# Altium schematic sheet Main.SchDoc
size A3; SheetNumber: 1; SheetTotal: 10
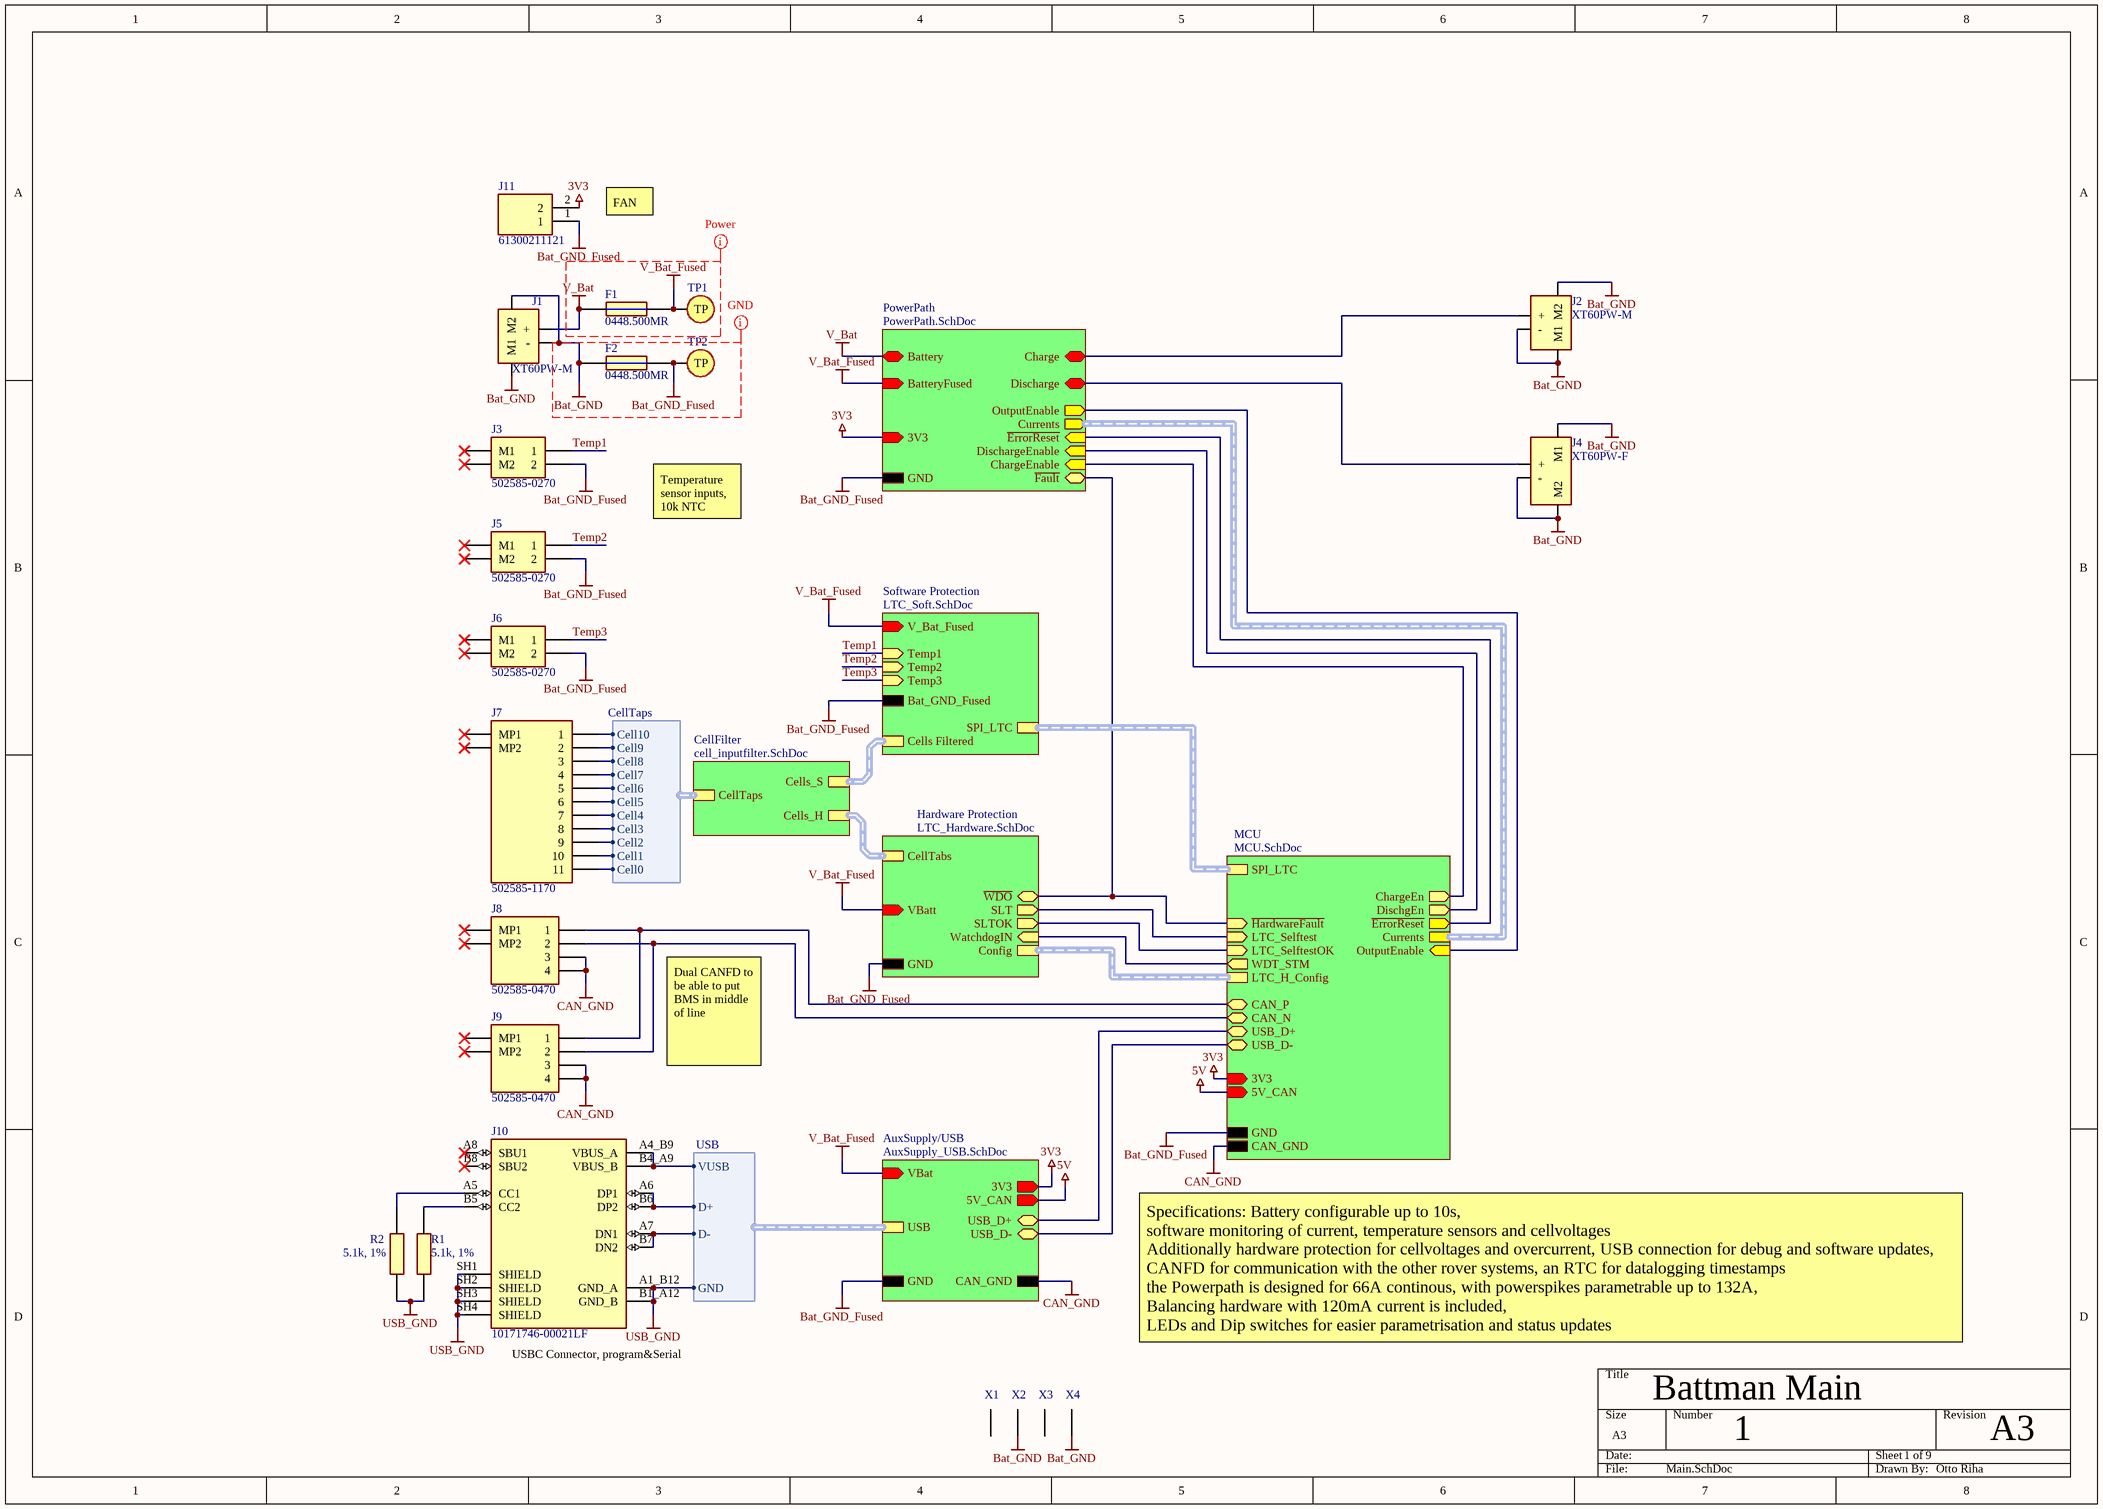
[diagram p0: Main.SchDoc]

## Parts
F1  0448.500MR  [FUSC6127X294N]
F2  0448.500MR  [FUSC6127X294N]
J1  XT60PW-M  [XT60PWM]
J2  XT60PW-M  [XT60PWM]
J3  502585-0270  [5025850270]
J4  XT60PW-F  [XT60PWF]
J5  502585-0270  [5025850270]
J6  502585-0270  [5025850270]
J7  502585-1170  [5025851170]
J8  502585-0470  [5025850470]
J9  502585-0470  [5025850470]
J10  10171746-00021LF  [AMPHENOL_10171746-00021LF]
J11  61300211121  [HDRV2W110P0X254_1X2_508X254X854P]
R1  5.1k, 1%  [RESC1608X55N]
R2  5.1k, 1%  [RESC1608X55N]
TP1  Testpoint  [Testpoint]  (value not drawn)
TP2  Testpoint  [Testpoint]  (value not drawn)
X1  Trou pour Vis M3 celon DIN912  [VisM3]  (value not drawn)
X2  Trou pour Vis M3 celon DIN912  [VisM3]  (value not drawn)
X3  Trou pour Vis M3 celon DIN912  [VisM3]  (value not drawn)
X4  Trou pour Vis M3 celon DIN912  [VisM3]  (value not drawn)

## Sub-sheets
AuxSupply/USB = AuxSupply_USB.SchDoc: VBat (in), GND, 5V_CAN (out), 3V3 (out), USB (harness USB), USB_D+ (bidir), USB_D- (bidir), CAN_GND
CellFilter = cell_inputfilter.SchDoc: CellTaps (harness CellTaps), Cells_H (harness Hardware Protection Taps), Cells_S (harness Software Protection Taps)
Hardware Protection = LTC_Hardware.SchDoc: CellTabs (harness Hardware Protection Taps), SLT (out), SLTOK (out), Config (harness LTC_H_Config), WatchdogIN (in), ~{WDO} (bidir), GND, VBatt (in)
MCU = MCU.SchDoc: SPI_LTC (harness SPI_LTC), CAN_P (bidir), CAN_N (bidir), USB_D+ (bidir), USB_D- (bidir), 3V3 (in), 5V_CAN (in), GND, LTC_H_Config (harness LTC_H_Config), ChargeEn (out), DischgEn (out), WDT_STM (out), ~{HardwareFault} (in), LTC_Selftest (in), LTC_SelftestOK (in), ~{ErrorReset} (out), OutputEnable (in), Currents (harness Currents), CAN_GND
PowerPath = PowerPath.SchDoc: Battery (bidir), BatteryFused (in), 3V3 (in), GND, Currents (out), Charge (bidir), ~{Fault} (bidir), Discharge (bidir), ChargeEnable (in), DischargeEnable (in), OutputEnable (out), ~{ErrorReset} (in)
Software Protection = LTC_Soft.SchDoc: Cells Filtered (harness Software Protection Taps), V_Bat_Fused (in), Bat_GND_Fused, Temp1 (in), Temp2 (in), Temp3 (in), SPI_LTC (harness SPI)

## Harnesses
CellTaps: Cell0, Cell1, Cell2, Cell3, Cell4, Cell5, Cell6, Cell7, Cell8, Cell9, Cell10
USB: VUSB, D+, D-, GND

## Nets
3V3: J11.2 ; sheet AuxSupply/USB/3V3, sheet MCU/3V3, sheet PowerPath/3V3
5V: sheet AuxSupply/USB/5V_CAN, sheet MCU/5V_CAN
Bat_GND: F2.1 J1.1(-) J1.M1 J1.M2 J2.1(-) J2.M1 J2.M2 J4.2(-) J4.3(M1) J4.4(M2) X2.1(M1) X4.1(M1)
Bat_GND_Fused: F2.2 J3.2 J5.2 J6.2 J11.1 TP2.1(TP) ; sheet Hardware Protection/GND, sheet AuxSupply/USB/GND, sheet Software Protection/Bat_GND_Fused, sheet MCU/GND, sheet PowerPath/GND
CAN_GND: J8.3 J8.4 J9.3 J9.4 ; sheet AuxSupply/USB/CAN_GND, sheet MCU/CAN_GND
USB_GND: J10.A1_B12(GND_A) J10.B1_A12(GND_B) J10.SH1(SHIELD) J10.SH2(SHIELD) J10.SH3(SHIELD) J10.SH4(SHIELD) R1.1 R2.1 ; sheet AuxSupply/USB/USB.GND
V_Bat: F1.1 J1.2(+) ; sheet PowerPath/Battery
V_Bat_Fused: F1.2 TP1.1(TP) ; sheet Hardware Protection/VBatt, sheet AuxSupply/USB/VBat, sheet Software Protection/V_Bat_Fused, sheet PowerPath/BatteryFused
Temp1: J3.1 ; sheet Software Protection/Temp1
Temp2: J5.1 ; sheet Software Protection/Temp2
Temp3: J6.1 ; sheet Software Protection/Temp3
NetJ2_2: J2.2(+) ; sheet PowerPath/Charge
NetJ4_1: J4.1(+) ; sheet PowerPath/Discharge
NetJ7_1: J7.1 ; sheet CellFilter/CellTaps.Cell10
NetJ7_2: J7.2 ; sheet CellFilter/CellTaps.Cell9
NetJ7_3: J7.3 ; sheet CellFilter/CellTaps.Cell8
NetJ7_4: J7.4 ; sheet CellFilter/CellTaps.Cell7
NetJ7_5: J7.5 ; sheet CellFilter/CellTaps.Cell6
NetJ7_6: J7.6 ; sheet CellFilter/CellTaps.Cell5
NetJ7_7: J7.7 ; sheet CellFilter/CellTaps.Cell4
NetJ7_8: J7.8 ; sheet CellFilter/CellTaps.Cell3
NetJ7_9: J7.9 ; sheet CellFilter/CellTaps.Cell2
NetJ7_10: J7.10 ; sheet CellFilter/CellTaps.Cell1
NetJ7_11: J7.11 ; sheet CellFilter/CellTaps.Cell0
NetJ8_1: J8.1 J9.1 ; sheet MCU/CAN_P
NetJ8_2: J8.2 J9.2 ; sheet MCU/CAN_N
NetJ10_A4_B9: J10.A4_B9(VBUS_A) J10.B4_A9(VBUS_B) ; sheet AuxSupply/USB/USB.VUSB
NetJ10_A5: J10.A5(CC1) R2.2
NetJ10_A6: J10.A6(DP1) J10.B6(DP2) ; sheet AuxSupply/USB/USB.D+
NetJ10_A7: J10.A7(DN1) J10.B7(DN2) ; sheet AuxSupply/USB/USB.D-
NetJ10_B5: J10.B5(CC2) R1.2
(unnamed): sheet Hardware Protection/SLT, sheet MCU/LTC_Selftest
(unnamed): sheet Hardware Protection/SLTOK, sheet MCU/LTC_SelftestOK
(unnamed): sheet Hardware Protection/WatchdogIN, sheet MCU/WDT_STM
(unnamed): sheet Hardware Protection/~{WDO}, sheet MCU/~{HardwareFault}, sheet PowerPath/~{Fault}
(unnamed): sheet AuxSupply/USB/USB_D+, sheet MCU/USB_D+
(unnamed): sheet AuxSupply/USB/USB_D-, sheet MCU/USB_D-
(unnamed): sheet MCU/ChargeEn, sheet PowerPath/ChargeEnable
(unnamed): sheet MCU/DischgEn, sheet PowerPath/DischargeEnable
(unnamed): sheet MCU/~{ErrorReset}, sheet PowerPath/~{ErrorReset}
(unnamed): sheet MCU/OutputEnable, sheet PowerPath/OutputEnable

Not connected (* = marked no-connect by the designer): J3 M1* M2*; J5 M1* M2*; J6 M1* M2*; J7 MP1* MP2*; J8 MP1* MP2*; J9 MP1* MP2*; J10 A8(SBU1)* B8(SBU2)*; X1 1(M1); X3 1(M1)

## Buses and harness runs
harness sheet CellFilter/Cells_H = sheet Hardware Protection/CellTabs
harness sheet CellFilter/Cells_S = sheet Software Protection/Cells Filtered
harness sheet Hardware Protection/Config = sheet MCU/LTC_H_Config
harness sheet MCU/Currents = sheet PowerPath/Currents
harness sheet MCU/SPI_LTC = sheet Software Protection/SPI_LTC

## Layout directives
net class GND: Bat_GND, Bat_GND_Fused
net class Batt+: V_Bat, V_Bat_Fused

## Notes on the sheet
- FAN
- Temperature sensor inputs, 10k NTC
- Dual CANFD to be able to put BMS in middle of line
- (near J10) USBC Connector, program&Serial
- Specifications: Battery configurable up to 10s,
  software monitoring of current, temperature sensors and cellvoltages
  Additionally hardware protection for cellvoltages and overcurrent, USB connection for debug and software updates, CANFD for communication with the other rover systems, an RTC for datalogging timestamps
  the Powerpath is designed for 66A continous, with powerspikes parametrable up to 132A,
  Balancing hardware with 120mA current is included,
  LEDs and Dip switches for easier parametrisation and status updates
- Battman Main
- 1
- 9
- A3
- Otto Riha
- System:
- Car Number:
- Author:
- 127
- Date:
- Sheet
- of
- Version :

## Library data of the parts
F1 F2 = 0448.500MR: Fuse; Manufacturer_Name: LITTELFUSE; Datasheet Link: https://www.mouser.in/datasheet/2/240/Littelfuse_Fuse_448_Datasheet_pdf-970935.pdf; Height: 2.94mm; Manufacturer_Part_Number: 0448.500MR; Mouser Part Number: 576-0448.500MR; Mouser Price/Stock: https://www.mouser.co.uk/ProductDetail/Littelfuse/0448.500MR?qs=sba%2FvSn%252BnuOI9c6%252BQVFrGA%3D%3D; Arrow Part Number: 0448.500MR; Arrow Price/Stock: https://www.arrow.com/en/products/0448.500mr/littelfuse
J1 J2 = XT60PW-M: Connector; Manufacturer_Name: Changzou Amass Elec; Datasheet Link: https://www.tme.eu/Document/9b8d0c5eb7094295f3d3112c214d3ade/XT60PW%20SPEC.pdf; Height: 8.4mm; Manufacturer_Part_Number: XT60PW-M
J3 J5 J6 = 502585-0270: Connector; Manufacturer_Name: Molex; Datasheet Link: https://www.molex.com/pdm_docs/sd/5025850270_sd.pdf; Height: 6.35mm; Manufacturer_Part_Number: 502585-0270; Mouser Part Number: 538-502585-0270; Mouser Price/Stock: https://www.mouser.co.uk/ProductDetail/Molex/502585-0270?qs=3OKVfsn1b5AIV0Cqykd0DA%3D%3D; Arrow Part Number: 502585-0270; Arrow Price/Stock: https://www.arrow.com/en/products/502585-0270/molex
J4 = XT60PW-F: Connector; Manufacturer_Name: Amass; Datasheet Link: https://www.tme.eu/Document/1191bc2fa3aee3c446e5a895fd8f7983/XT60PW-F.pdf; Height: 8.4mm; Manufacturer_Part_Number: XT60PW-F
J7 = 502585-1170: Connector; Manufacturer_Name: Molex; Datasheet Link: https://www.molex.com/pdm_docs/sd/5025851070_sd.pdf; Height: 6.35mm; Manufacturer_Part_Number: 502585-1170; Mouser Part Number: 538-502585-1170; Mouser Price/Stock: https://www.mouser.co.uk/ProductDetail/Molex/502585-1070?qs=3OKVfsn1b5BLfpTO0z92Dw%3D%3D; Arrow Part Number: 502585-1070; Arrow Price/Stock: https://www.arrow.com/en/products/502585-1070/molex
J8 J9 = 502585-0470: Connector; Manufacturer_Name: Molex; Height: 6.6mm; Manufacturer_Part_Number: 502585-0470; Mouser Part Number: 538-502585-0470; Mouser Price/Stock: https://www.mouser.co.uk/ProductDetail/Molex/502585-0470?qs=3OKVfsn1b5AU8ip3wCejKg%3D%3D; Arrow Part Number: 502585-0470; Arrow Price/Stock: https://www.arrow.com/en/products/5025850470/molex
J10 = 10171746-00021LF: USB-C (USB TYPE-C) USB 2.0 Receptacle Connector 24 (6+18 Dummy) Position Surface Mount, Right Angle; Through Hole; MF: Amphenol; SnapEDA_Link: https://www.snapeda.com/parts/10171746-00021LF/Amphenol/view-part/?ref=snap; Package: None; Value: *; MP: 10171746-00021LF; Check_prices: https://www.snapeda.com/parts/10171746-00021LF/Amphenol/view-part/?ref=eda
J11 = 61300211121: Connector; Manufacturer_Name: Wurth Elektronik; Datasheet Link: https://componentsearchengine.com/Datasheets/2/61300211121.pdf; Height: 8.54mm; Manufacturer_Part_Number: 61300211121; Mouser Part Number: 710-61300211121; Mouser Price/Stock: https://www.mouser.co.uk/ProductDetail/Wurth-Elektronik/61300211121?qs=t4813l51qx%252B1A5GYDQxPlw%3D%3D
R1 R2 = CRCW06035K10FKEBC: Resistor 5.1k, 1%; Manufacturer_Name: Vishay; Datasheet Link: https://www.vishay.com/docs/28773/crcwce3.pdf; Height: 0.55mm; Manufacturer_Part_Number: CRCW06035K10FKEBC; Mouser Part Number: 71-CRCW06035K10FKEBC; Mouser Price/Stock: https://www.mouser.co.uk/ProductDetail/Vishay-Dale/CRCW06035K10FKEBC?qs=wd5RIQLrsJiajonkePuzqw%3D%3D; Arrow Part Number: CRCW06035K10FKEBC; Arrow Price/Stock: https://www.arrow.com/en/products/crcw06035k10fkebc/vishay?region=nac; Value: 5.1k; Supplier 1: Mouser; Supplier Part Number 1: 71-CRCW06035K10FKEBC
X1-X4 = VisM3